# Altium schematic sheet USB.SchDoc
size A3; SheetNumber: 6; SheetTotal: 9
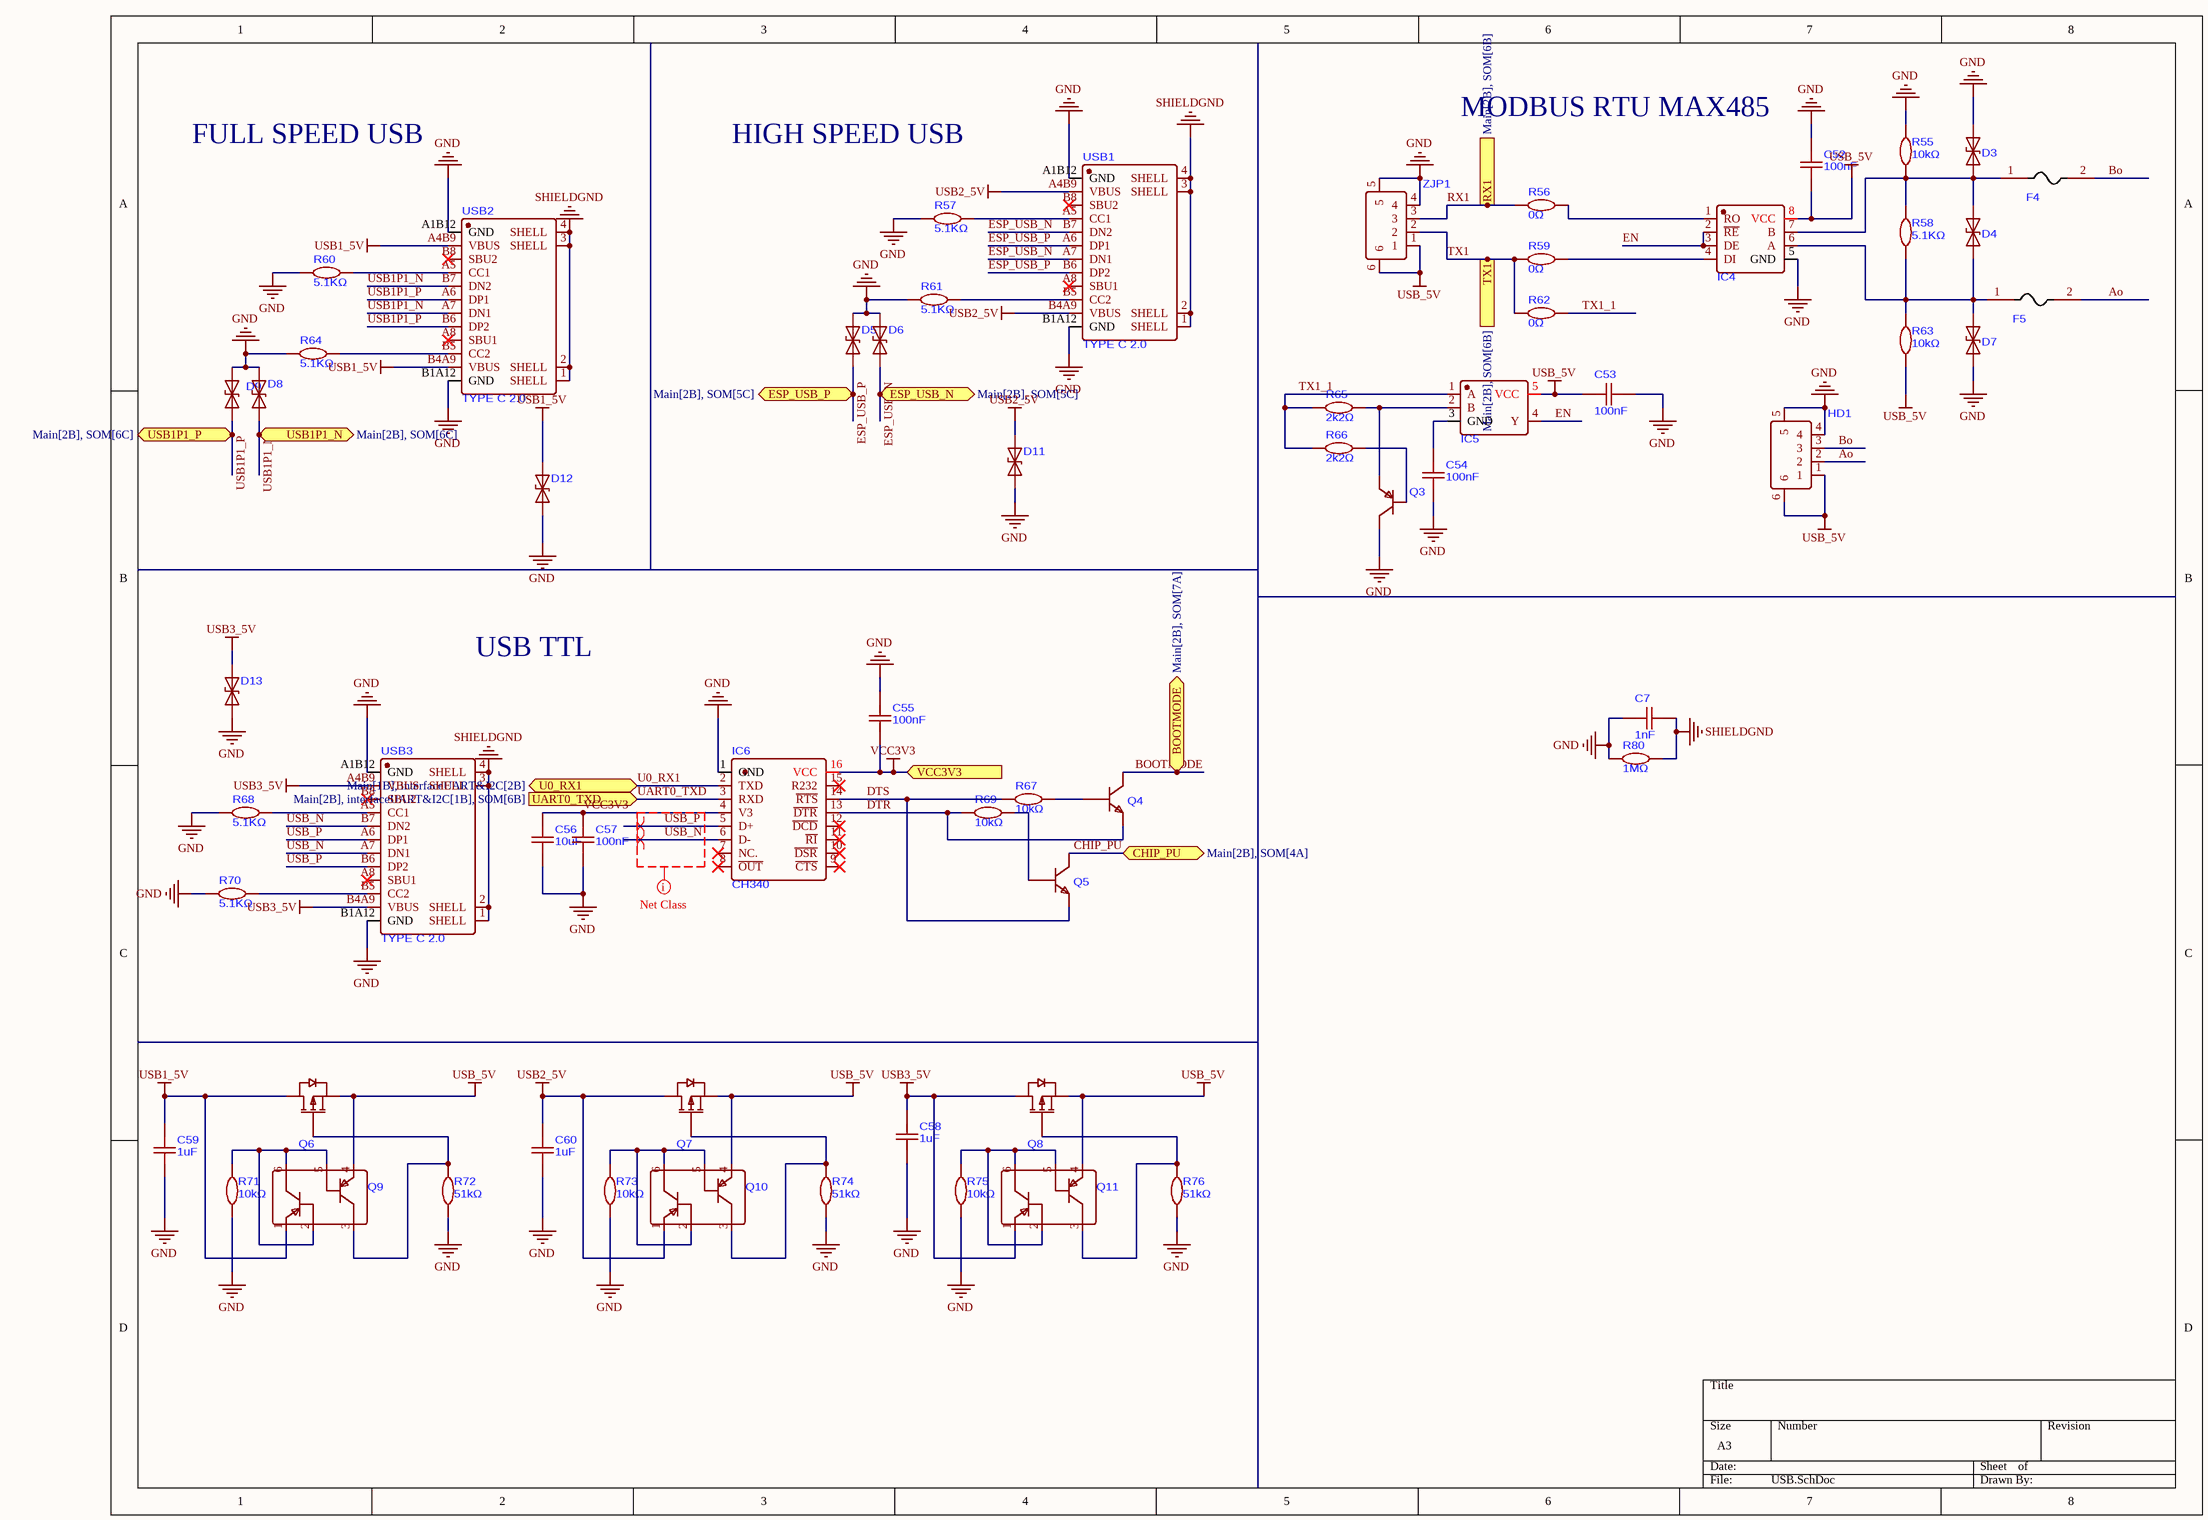
[diagram p0: USB.SchDoc]

## Parts
C7  1nF  [C1808]
C52  100nF  [C0603]
C53  100nF  [C0603]
C54  100nF  [C0603]
C55  100nF  [C0603]
C56  10uF  [C0603]
C57  100nF  [C0603]
C58  1uF  [C0603]
C59  1uF  [C0603]
C60  1uF  [C0603]
D3  TVS DIODE 5VWM 18.6VC SOD-523  [SOD-523_L1.2-W0.8-LS1.6-BI]  (value not drawn)
D4  TVS DIODE 5VWM 18.6VC SOD-523  [SOD-523_L1.2-W0.8-LS1.6-BI]  (value not drawn)
D5  TVS DIODE 5VWM 18.6VC SOD-523  [SOD-523_L1.2-W0.8-LS1.6-BI]  (value not drawn)
D6  TVS DIODE 5VWM 18.6VC SOD-523  [SOD-523_L1.2-W0.8-LS1.6-BI]  (value not drawn)
D7  TVS DIODE 5VWM 18.6VC SOD-523  [SOD-523_L1.2-W0.8-LS1.6-BI]  (value not drawn)
D8  TVS DIODE 5VWM 18.6VC SOD-523  [SOD-523_L1.2-W0.8-LS1.6-BI]  (value not drawn)
D9  TVS DIODE 5VWM 18.6VC SOD-523  [SOD-523_L1.2-W0.8-LS1.6-BI]  (value not drawn)
D11  TVS DIODE 5VWM 18.6VC SOD-523  [SOD-523_L1.2-W0.8-LS1.6-BI]  (value not drawn)
D12  TVS DIODE 5VWM 18.6VC SOD-523  [SOD-523_L1.2-W0.8-LS1.6-BI]  (value not drawn)
D13  TVS DIODE 5VWM 18.6VC SOD-523  [SOD-523_L1.2-W0.8-LS1.6-BI]  (value not drawn)
F4  PTC RESET FUSE 24V 100mA 0603  [F0603]  (value not drawn)
F5  PTC RESET FUSE 24V 100mA 0603  [F0603]  (value not drawn)
HD1  533980471  [CONN-SMD_4P-P1.25_XUNPU_WAFER-GH1.25-4PWB]  (value not drawn)
IC4  Low-Power, Slew-Rate-Limited RS-485/RS-422 Transceivers  [SOP-8_L4.9-W3.9-P1.27-LS6.0-BL]  (value not drawn)
IC5  SINGLE 2-INPUT NAND GATE WITH SCHMITT-TRIGGER INPUTS  [SOT-23-5_L3.0-W1.7-P0.95-LS2.8-BL]  (value not drawn)
IC6  CH340  [SOP-16_L10.0-W3.9-P1.27-LS6.0-BL]
Q3  TRANS PNP 25V 1.5A SOT-23  [SOT-23-3_L2.9-W1.3-P1.90-LS2.4-BR]  (value not drawn)
Q4  TRANS NPN 25V 0.5A SOT-23  [SOT-23-3_L2.9-W1.3-P1.90-LS2.4-BR]  (value not drawn)
Q5  TRANS NPN 25V 0.5A SOT-23  [SOT-23-3_L2.9-W1.3-P1.90-LS2.4-BR]  (value not drawn)
Q6  MOSFET P-CH 30V 4.3A SOT-23  [2SOT-23-3_L2.9-W1.6-P1.90-LS2.8-BR]  (value not drawn)
Q7  MOSFET P-CH 30V 4.3A SOT-23  [2SOT-23-3_L2.9-W1.6-P1.90-LS2.8-BR]  (value not drawn)
Q8  MOSFET P-CH 30V 4.3A SOT-23  [2SOT-23-3_L2.9-W1.6-P1.90-LS2.8-BR]  (value not drawn)
Q9  TRANS PNP 40V 200mA SOT-363  [SC-70-6_L2.2-W1.3-P0.65-LS2.1-TL]  (value not drawn)
Q10  TRANS PNP 40V 200mA SOT-363  [SC-70-6_L2.2-W1.3-P0.65-LS2.1-TL]  (value not drawn)
Q11  TRANS PNP 40V 200mA SOT-363  [SC-70-6_L2.2-W1.3-P0.65-LS2.1-TL]  (value not drawn)
R55  10kΩ  [R0603]
R56  0Ω  [R0603]
R57  5.1KΩ  [R0603]
R58  5.1KΩ  [R0603]
R59  0Ω  [R0603]
R60  5.1KΩ  [R0603]
R61  5.1KΩ  [R0603]
R62  0Ω  [R0603]
R63  10kΩ  [R0603]
R64  5.1KΩ  [R0603]
R65  2k2Ω  [R0603]
R66  2k2Ω  [R0603]
R67  10kΩ  [R0603]
R68  5.1KΩ  [R0603]
R69  10kΩ  [R0603]
R70  5.1KΩ  [R0603]
R71  10kΩ  [R0603]
R72  51kΩ  [R0603]
R73  10kΩ  [R0603]
R74  51kΩ  [R0603]
R75  10kΩ  [R0603]
R76  51kΩ  [R0603]
R80  1MΩ  [R2010]
USB1  TYPE C 2.0  [USB-C-SMD_G-SWITCH_GT-USB-7010ASV]
USB2  TYPE C 2.0  [USB-C-SMD_G-SWITCH_GT-USB-7010ASV]
USB3  TYPE C 2.0  [USB-C-SMD_G-SWITCH_GT-USB-7010ASV]
ZJP1  533980471  [CONN-SMD_4P-P1.25_XUNPU_WAFER-GH1.25-4PWB]  (value not drawn)

## Ports
BOOTMODE (bidir, see Main[2B], SOM[7A]), CHIP_PU (bidir, see Main[2B], SOM[4A]), ESP_USB_N (bidir, see Main[2B], SOM[5C]), ESP_USB_P (bidir, see Main[2B], SOM[5C]), RX1 (out, see Main[2B], SOM[6B]), TX1 (in, see Main[2B], SOM[6B]), U0_RX1 (bidir, see Main[1B], interfaceUART&I2C[2B]), UART0_TXD (in, see Main[2B], interfaceUART&I2C[1B], SOM[6B]), USB1P1_N (bidir, see Main[2B], SOM[6C]), USB1P1_P (bidir, see Main[2B], SOM[6C]), VCC3V3 (in, see Main[1B], Power[2B], SOM[4A])

## Nets
GND: C7.1 C52.2 C53.1 C54.1 C55.2 C56.1 C57.1 C58.1 C59.1 C60.1 D3.2(A) D5.2(A) D6.2(A) D7.1(K) D8.2(A) D9.2(A) D11.1(K) D12.1(K) D13.1(K) HD1.4 HD1.5 IC4.5(GND) IC6.1(GND) Q3.3(C) R55.2 R57.1 R60.1 R61.1 R64.1 R68.1 R70.1 R71.1 R72.1 R73.1 R74.1 R75.1 R76.1 R80.1 USB1.A1B12(GND) USB1.B1A12(GND) USB2.A1B12(GND) USB2.B1A12(GND) USB3.A1B12(GND) USB3.B1A12(GND) ZJP1.4 ZJP1.5
SHIELDGND: C7.2 R80.2 USB1.1(SHELL) USB1.2(SHELL) USB1.3(SHELL) USB1.4(SHELL) USB2.1(SHELL) USB2.2(SHELL) USB2.3(SHELL) USB2.4(SHELL) USB3.1(SHELL) USB3.2(SHELL) USB3.3(SHELL) USB3.4(SHELL)
USB1_5V: C59.2 D12.2(A) Q6.3(D) Q9.1(E2) USB2.A4B9(VBUS) USB2.B4A9(VBUS)
USB2_5V: C60.2 D11.2(A) Q7.3(D) Q10.1(E2) USB1.A4B9(VBUS) USB1.B4A9(VBUS)
USB3_5V: C58.2 D13.2(A) Q8.3(D) Q11.1(E2) USB3.A4B9(VBUS) USB3.B4A9(VBUS)
USB_5V: C52.1 C53.2 HD1.1 HD1.6 IC4.8(VCC) IC5.5(VCC) Q6.2(S) Q7.2(S) Q8.2(S) Q9.4(E1) Q10.4(E1) Q11.4(E1) R63.1 ZJP1.1 ZJP1.6
VCC3V3: C55.1 C56.2 C57.2 IC6.4(V3) IC6.16(VCC) ; port VCC3V3
Ao: F5.2 HD1.2
Bo: F4.2 HD1.3
BOOTMODE: Q4.3(C) ; port BOOTMODE
CHIP_PU: Q5.3(C) ; port CHIP_PU
DTR: IC6.13(~{DTR}) Q4.2(E) R69.1
DTS: IC6.14(~{RTS}) Q5.2(E) R67.1
EN: IC4.2(~{RE}) IC4.3(DE) IC5.4(Y)
ESP_USB_N: D6.1(K) USB1.A7(DN1) USB1.B7(DN2) ; port ESP_USB_N
ESP_USB_P: D5.1(K) USB1.A6(DP1) USB1.B6(DP2) ; port ESP_USB_P
RX1: R56.1 ZJP1.3 ; port RX1
TX1: R59.1 R62.1 ZJP1.2 ; port TX1
TX1_1: IC5.1(A) R62.2 R65.2 R66.1
U0_RX1: IC6.2(TXD) ; port U0_RX1
UART0_TXD: IC6.3(RXD) ; port UART0_TXD
USB1P1_N: D8.1(K) USB2.A7(DN1) USB2.B7(DN2) ; port USB1P1_N
USB1P1_P: D9.1(K) USB2.A6(DP1) USB2.B6(DP2) ; port USB1P1_P
USB_N: IC6.6(D-) USB3.A7(DN1) USB3.B7(DN2)
USB_P: IC6.5(D+) USB3.A6(DP1) USB3.B6(DP2)
NetC54_2: C54.2 IC5.3(GND)
NetD3_1: D3.1(K) D4.2(A) F4.1 IC4.7(B) R55.1 R58.2
NetD4_1: D4.1(K) D7.2(A) F5.1 IC4.6(A) R58.1 R63.2
NetIC4_1: IC4.1(RO) R56.2
NetIC4_4: IC4.4(DI) R59.2
NetIC5_2: IC5.2(B) Q3.2(E) R65.1
NetQ3_1: Q3.1(B) R66.2
NetQ4_1: Q4.1(B) R67.2
NetQ5_1: Q5.1(B) R69.2
NetQ6_1: Q6.1(G) Q9.3(C1) R72.2
NetQ7_1: Q7.1(G) Q10.3(C1) R74.2
NetQ8_1: Q8.1(G) Q11.3(C1) R76.2
NetQ9_2: Q9.2(B2) Q9.5(B1) Q9.6(C2) R71.2
NetQ10_2: Q10.2(B2) Q10.5(B1) Q10.6(C2) R73.2
NetQ11_2: Q11.2(B2) Q11.5(B1) Q11.6(C2) R75.2
NetR57_2: R57.2 USB1.A5(CC1)
NetR60_2: R60.2 USB2.A5(CC1)
NetR61_2: R61.2 USB1.B5(CC2)
NetR64_2: R64.2 USB2.B5(CC2)
NetR68_2: R68.2 USB3.A5(CC1)
NetR70_2: R70.2 USB3.B5(CC2)

Not connected (* = marked no-connect by the designer): IC6 7(NC.)* 8(~{OUT})* 9(~{CTS})* 10(~{DSR})* 11(~{RI})* 12(~{DCD})* 15(R232)*; USB1 A8(SBU1)* B8(SBU2)*; USB2 A8(SBU1)* B8(SBU2)*; USB3 A8(SBU1)* B8(SBU2)*

## Layout directives
net class USB: USB_N, USB_P
differential pair; net class DIFF90; differential pair class DIFF90: USB_N, USB_P

## Notes on the sheet
- MODBUS RTU MAX485
- FULL SPEED USB
- HIGH SPEED USB
- USB TTL

## Library data of the parts
C7 = CL10B102KB8NNNC: 50V 1nF X7R ±10% 0603 Ceramic Capacitors ROHS
C52-C55 C57 = CC0603KRX7R9BB104: 50V 100nF X7R ±10% 0603 Ceramic Capacitors ROHS
C56 = CL10A106MA8NRNC: 25V 10uF X5R ±20% 0603 Ceramic Capacitors ROHS
C58-C60 = CL10B105KA8NNNC: 25V 1uF X7R ±10% 0603 Ceramic Capacitors ROHS
D3-D9 D11-D13 = LESD5D5.0CT1G: 9.4A@8/20us 18.6V 7.8V 5V SOD-523 TVS Diodes RoHS
F4 F5 = 0603-010-24V: 24V 100mA 40A 300mA 900mΩ 0603 PTC Resettable Fuses RoHS
HD1 ZJP1 = 533980471: 4P PicoBlade(MX 1.25) 1x4P Tin -40℃~+105℃ White 1.25mm 125V 4 1A 1 Surface Mount,Vertical SMD,P=1.25mm Headers, Male Pins RoHS
IC4 = MAX485ESA+T_C41365333: Transceiver 4.75V~5.25V SOIC-8 Drivers, Receivers, Transceivers RoHS
IC5 = TP74LVC1G132S5: 5ns@5V,50pF 10uA 1.65V~5.5V NAND Gate SOT-23-5 Gates and Inverters RoHS
IC6 = CH340C: Transceiver USB 2.0 SOP-16 Interface Controllers RoHS
Q3 = SS8550_C7420371: 300mW 25V 1.5A PNP SOT-23 Single Bipolar Transistors RoHS
Q4 Q5 = S8050_C2828466: 300mW 25V 500mA NPN SOT-23 Single Bipolar Transistors RoHS
Q6-Q8 = AO3407A: 30V 4.3A 48mΩ@10V 2.5V@250uA 1 P-Channel SOT-23 Single FETs, MOSFETs ROHS
Q9-Q11 = LMBT3906DW1T1: 40V 150mW 200mA PNP SOT-363 Single Bipolar Transistors RoHS
R55 R63 R67 R69 R71 R73 R75 = RC0603FR-0710KL: 100mW 10kΩ 75V ±100ppm/℃ Thick Film Resistor ±1% 0603 Chip Resistor - Surface Mount ROHS
R56 R59 R62 = RC0603JR-070RL: 100mW 0Ω 75V Thick Film Resistor ±5% 0603 Chip Resistor - Surface Mount RoHS
R57 R58 R60 R61 R64 R68 R70 = FRC0603F5101TS: 100mW 5.1kΩ 75V ±100ppm/℃ Thick Film Resistor ±1% 0603 Chip Resistor - Surface Mount RoHS
R65 R66 = RC0603FR-072K2L: 100mW 2.2kΩ 75V ±100ppm/℃ Thick Film Resistor ±1% 0603 Chip Resistor - Surface Mount RoHS
R72 R74 R76 = RC0603FR-07100KL_1RC0603FR-0751KL: 100mW 51kΩ 75V ±100ppm/℃ Thick Film Resistor ±1% 0603 Chip Resistor - Surface Mount RoHS
R80 = RC0603FR-071ML: 100mW 1MΩ 75V Thick Film Resistor ±100ppm/℃ ±1% 0603 Chip Resistor - Surface Mount RoHS
USB1-USB3 = GT-USB-7010ASV: USB 2.0 1 16P -40℃~+85℃ Type-C SMD USB, DVI, HDMI Connector Assemblies RoHS